# Altium schematic sheet STM32_IO.SchDoc
size A; SheetNumber: 5; SheetTotal: 5
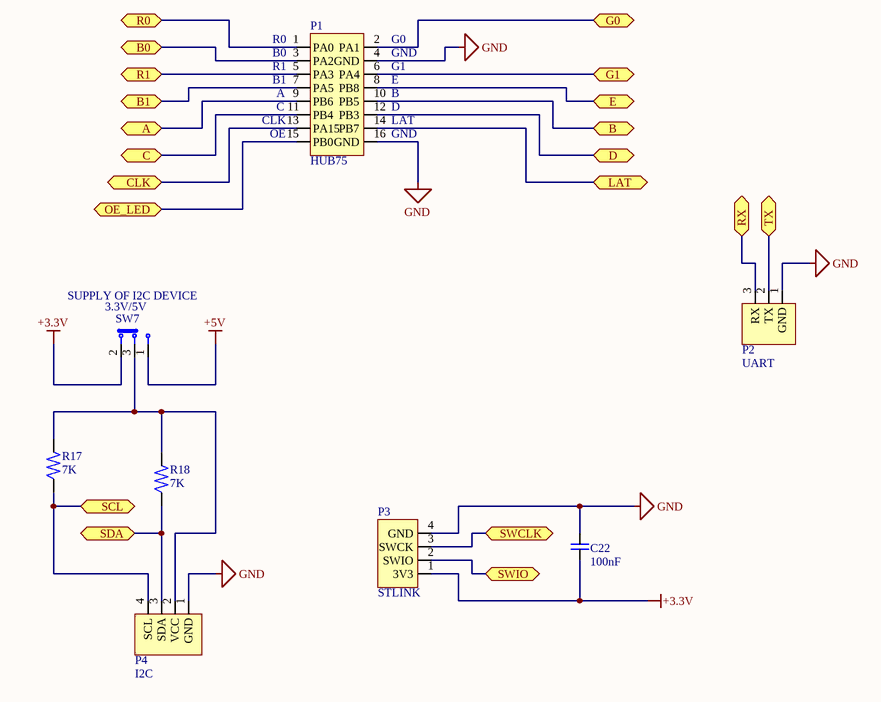
[diagram p0: STM32_IO.SchDoc]

## Parts
C22  100nF  [SMT_CAP_MODEL_1206(3216)_SAMSUNG]
P1  HUB75  [THT_CON_2316S-16G]
P2  UART  [SMT_CON_STRAIGHT_2417SJ-03-SM2]
P3  STLINK  [THT_STLINK_HEADER_4P_MALE]
P4  I2C  [SMT_CON_STRAIGHT_2417SJ-04-SM2]
R17  7K  [SMT_RES_MODEL_1206(3216)_ROHM]
R18  7K  [SMT_RES_MODEL_1206(3216)_ROHM]
SW7  3.3V/5V  [THT_SSW_ESP1010]

## Ports
A (bidir), B0 (bidir), B1 (bidir), B (bidir), C (bidir), CLK (bidir), D (bidir), E (bidir), G0 (bidir), G1 (bidir), LAT (bidir), OE_LED (bidir), R0 (bidir), R1 (bidir), RX (bidir), SCL (bidir), SDA (bidir), SWCLK (bidir), SWIO (bidir), TX (bidir)

## Nets
+3.3V: C22.1 P3.1(3V3) SW7.2
+5V: SW7.1
GND: C22.2 P1.4(GND) P1.16(GND) P2.1(GND) P3.4(GND) P4.1(GND)
A: P1.9(PB6) ; port A
B: P1.10(PB5) ; port B
B0: P1.3(PA2) ; port B0
B1: P1.7(PA5) ; port B1
C: P1.11(PB4) ; port C
CLK: P1.13(PA15) ; port CLK
D: P1.12(PB3) ; port D
E: P1.8(PB8) ; port E
G0: P1.2(PA1) ; port G0
G1: P1.6(PA4) ; port G1
LAT: P1.14(PB7) ; port LAT
OE_LED: P1.15(PB0) ; port OE_LED
R0: P1.1(PA0) ; port R0
R1: P1.5(PA3) ; port R1
RX: P2.3(RX) ; port RX
SCL: P4.4(SCL) R17.2 ; port SCL
SDA: P4.3(SDA) R18.2 ; port SDA
SWCLK: P3.3(SWCK) ; port SWCLK
SWIO: P3.2(SWIO) ; port SWIO
TX: P2.2(TX) ; port TX
NetP4_2: P4.2(VCC) R17.1 R18.1 SW7.3

## Notes on the sheet
- (near P1) R0
- (near P1) B0
- (near P1) R1
- (near P1) B1
- (near P1) G0
- (near P1) GND
- (near P1) G1
- (near P1) E
- (near P1) CLK
- (near P1) OE
- (near P1) A
- (near P1) C
- (near P1) B
- (near P1) D
- (near P1) LAT
- (near SW7) SUPPLY OF I2C DEVICE

## Library data of the parts
C22 = SMT_CAP_MODEL_1206(3216)_SAMSUNG: SMT Samsung Ceramic Capacitor MODEL *V *nF 1206(3216)  CL31B104KBCNNNC(etc.)
P1 = THT_CON_2316S-16G: Connector 2316S-16G 16 Pin 2.54 Pitch
P2 = SMT_CON_STRAIGHT_2417SJ-03-SM2: Connector 3P NELTRON 2417SJ-03-SM2-CR 100V/2A 2.0mm Pitch SMT
P3 = THT_STLINK_HEADER_4P_MALE: Dupont Header Male STLINK 4P 2.54 Pitch
P4 = SMT_CON_STRAIGHT_2417SJ-04-SM2: Connector 4P NELTRON 2417SJ-04-SM2-CR 100V/2A 2.0mm Pitch SMT
R17 R18 = SMT_RES_MODEL_1206(3216)_ROHM: SMT ROHM Resistor MODEL 1206(3216) 1/4W MCR18ERTJ000
SW7 = THT_SSW_ESP1010: Slide Switch ESP1010 12V 0.5A